# EAGLE design light-box-controller (EAGLE 9.6.2)

## Sheet 1 of 2
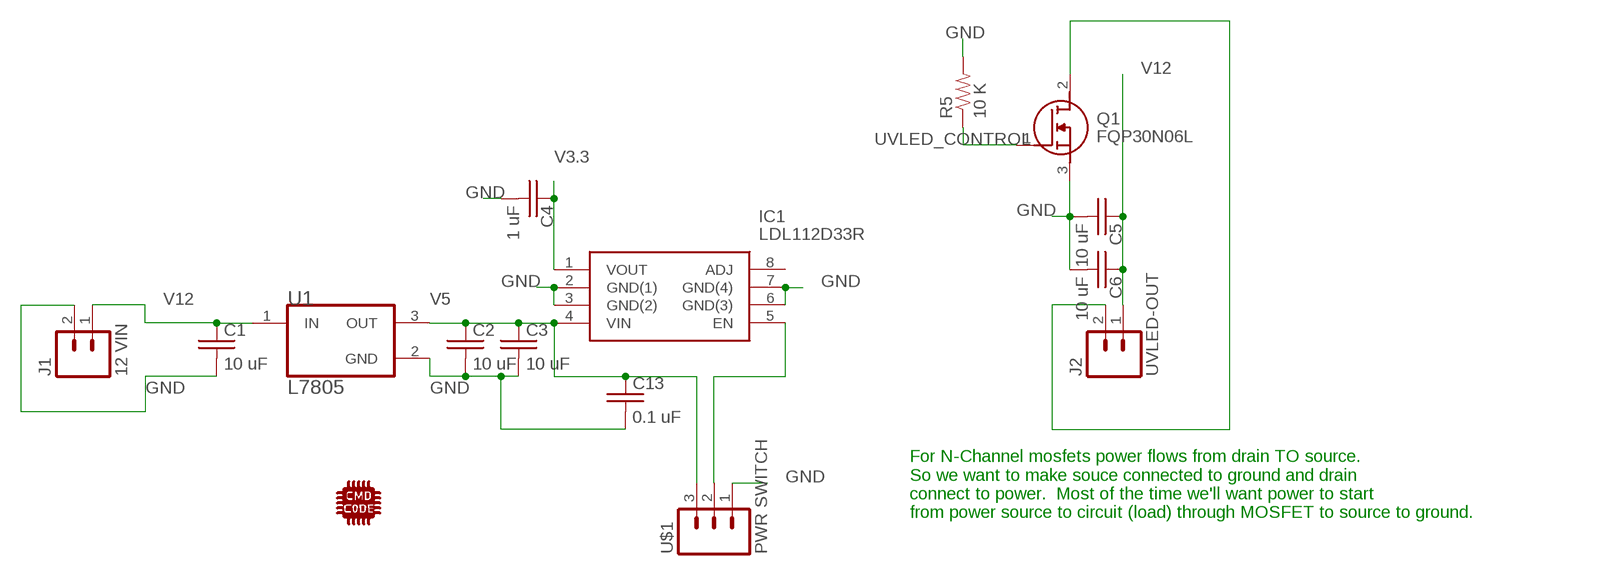
[diagram p0: schematic, sheet 1]

### Parts
C1  10 uF  C-USC0805K  [C0805K]
C2  10 uF  C-USC0805K  [C0805K]
C3  10 uF  C-USC0805K  [C0805K]
C4  1 uF  C-USC0805K  [C0805K]
C5  10 uF  C-USC0805K  [C0805K]
C6  10 uF  C-USC0805K  [C0805K]
C13  0.1 uF  C-USC0805K  [C0805K]
IC1  LDL112D33R  [SOIC127P600X175-8N]
J1  12 VIN  M025MM  [SCREWTERMINAL-5MM-2]
J2  UVLED-OUT  M025MM  [SCREWTERMINAL-5MM-2]
Q1  FQP30N06L  [TO254P470X1016X2019-3P]
R5  10 K  RESISTOR0805-RES  [0805]
U1  L7805  [TO-220-3]
U$1  PWR SWITCH  M03LONGPADS  [1X03_LONGPADS]
U$4  CMD_C0DE_LOGOCMD_CODE_LOGO_SILK  [CMD_C0DE_LOGO_SILK]

### Nets
GND: C1.2 C2.2 C3.2 C4.2 C5.2 C6.2 C13.2 IC1.2(GND(1)) IC1.3(GND(2)) IC1.6(GND(3)) IC1.7(GND(4)) J1.2 Q1.3(S) R5.2 U1.2(GND) U$1.1 ; also sheet 2
N$2: J2.2 Q1.2(D)
N$4: IC1.5(EN) U$1.2
UVLED_CONTROL: Q1.1(G) R5.1 ; also sheet 2
V3.3: C4.1 IC1.1(VOUT) ; also sheet 2
V5: C2.1 C3.1 C13.1 IC1.4(VIN) U1.3(OUT) U$1.3
V12: C1.1 C5.1 C6.1 J1.1 J2.1 U1.1(IN)
Unconnected: IC1.8(ADJ)

### Notes on the sheet
- For N-Channel mosfets power flows from drain TO source.  
  So we want to make souce connected to ground and drain 
  connect to power.  Most of the time we'll want power to start 
  from power source to circuit (load) through MOSFET to source to ground.

## Sheet 2 of 2
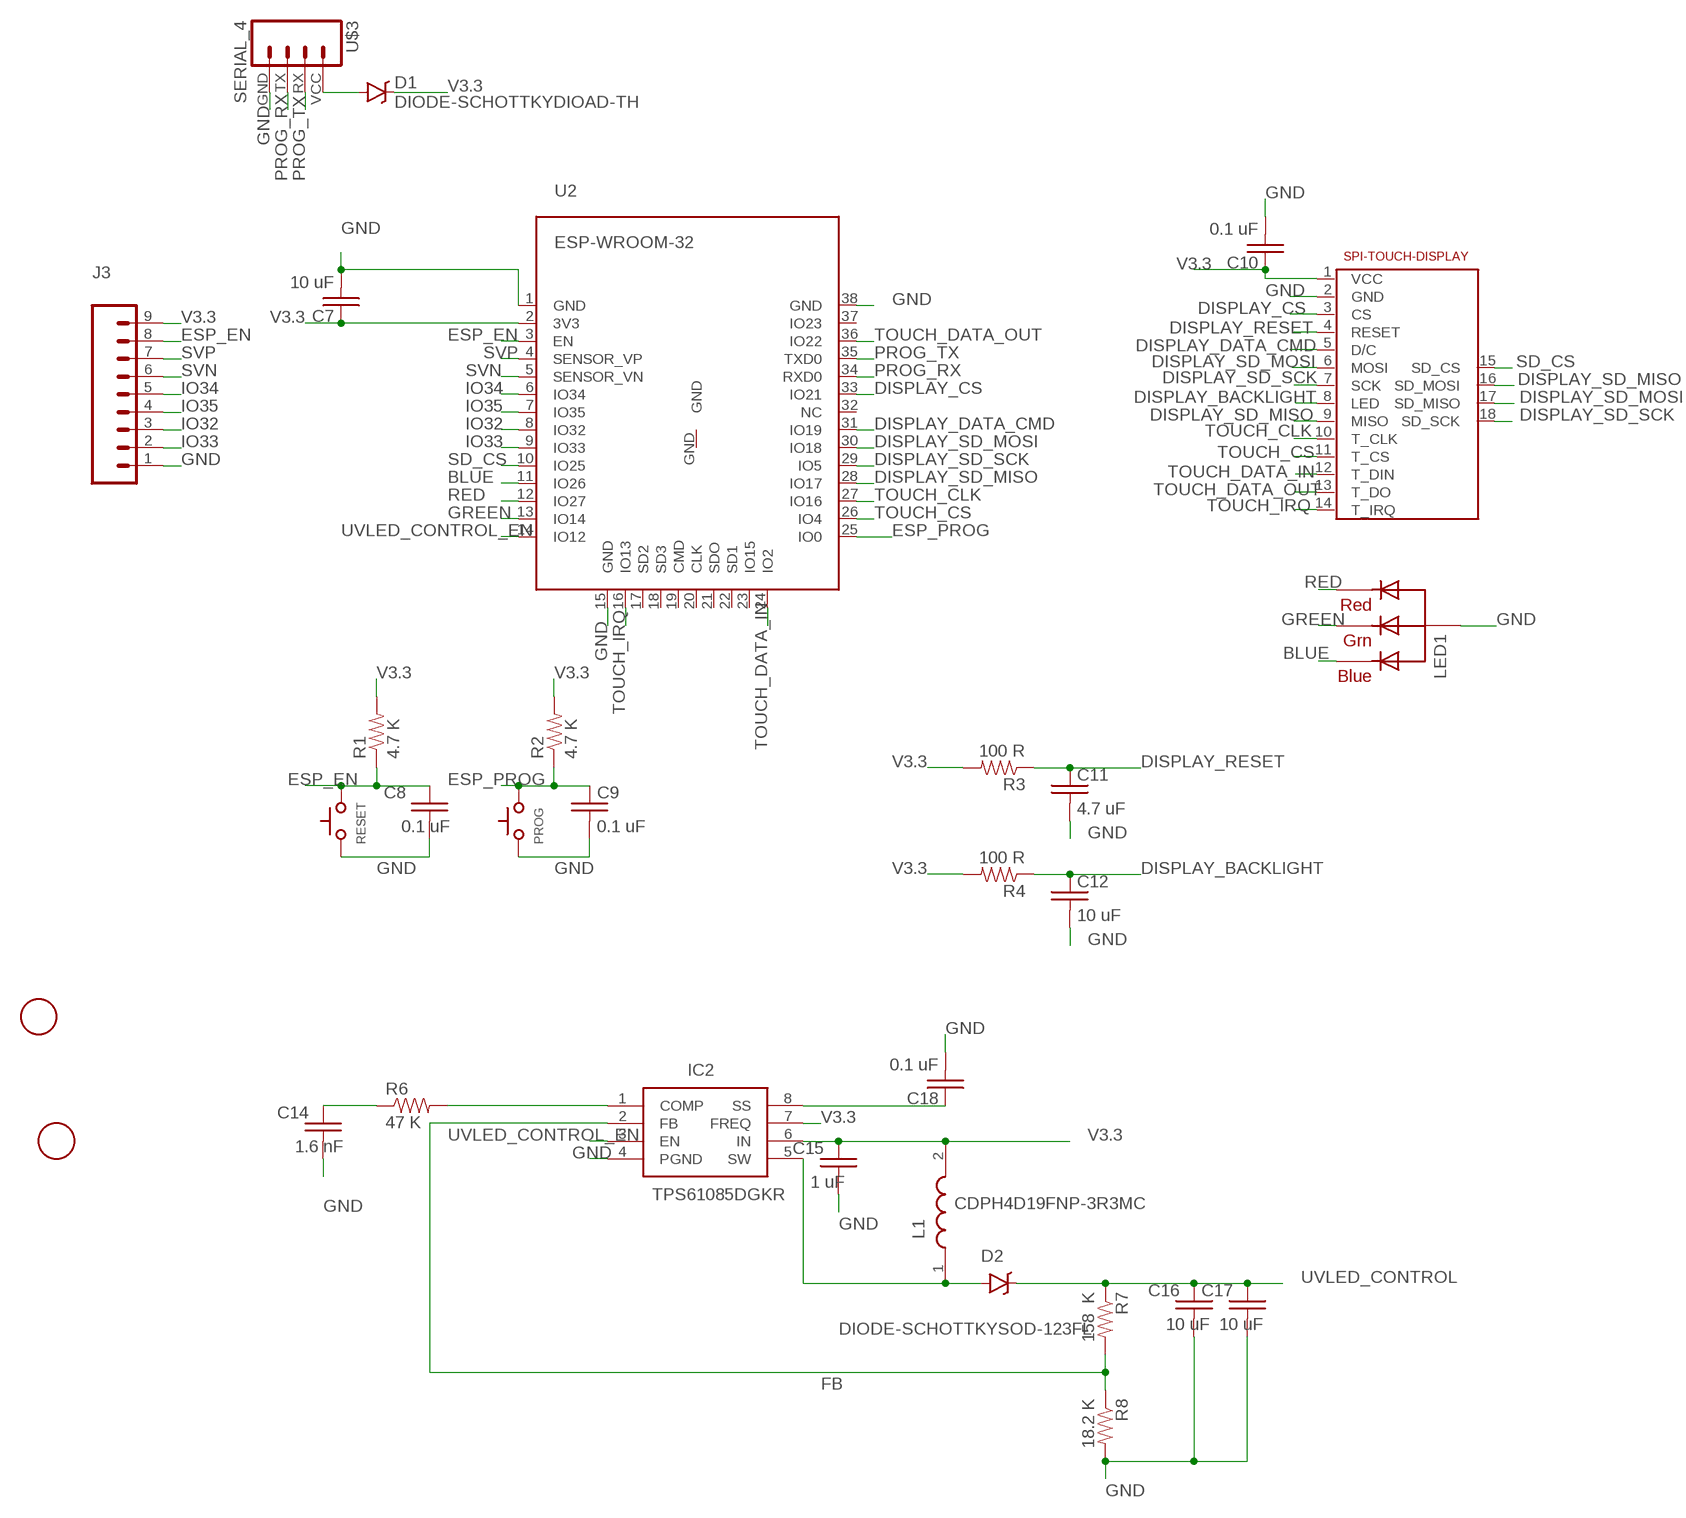
[diagram p1: schematic, sheet 2]

### Parts
C7  10 uF  C-USC0805K  [C0805K]
C8  0.1 uF  C-USC0805K  [C0805K]
C9  0.1 uF  C-USC0805K  [C0805K]
C10  0.1 uF  C-USC0805K  [C0805K]
C11  4.7 uF  C-USC0805K  [C0805K]
C12  10 uF  C-USC0805K  [C0805K]
C14  1.6 nF  C-USC0805K  [C0805K]
C15  1 uF  C-USC0805K  [C0805K]
C16  10 uF  C-USC0805K  [C0805K]
C17  10 uF  C-USC0805K  [C0805K]
C18  0.1 uF  C-USC0805K  [C0805K]
D1  DIODE-SCHOTTKYDIOAD-TH  [DIOAD1060W80L520D270]
D2  DIODE-SCHOTTKYSOD-123FL  [SOD-123FL]
IC2  TPS61085DGKR  [SOP65P490X110-8N]
J3  M09LONGPADS  [1X09_LONGPADS]
L1  CDPH4D19FNP-3R3MC  [CDPH4D19FNP3R3MC]
LED1  RGBLED_CA-PIRANHA  [PIRANHA5MM]
PROG  SWITCH_TACTILETACTILE-2PIN-NARROW  [TACTILE-2PIN-NARROW]
R1  4.7 K  RESISTOR0805-RES  [0805]
R2  4.7 K  RESISTOR0805-RES  [0805]
R3  100 R  RESISTOR0805-RES  [0805]
R4  100 R  RESISTOR0805-RES  [0805]
R6  47 K  RESISTOR0805-RES  [0805]
R7  158 K  RESISTOR0805-RES  [0805]
R8  18.2 K  RESISTOR0805-RES  [0805]
RESET  SWITCH_TACTILETACTILE-2PIN-NARROW  [TACTILE-2PIN-NARROW]
U2  ESP-WROOM-32  [ESP-WROOM-32]
U$2  2.4-SPI-TFT-TOUCH-SSD-MODULE  [2.4-SPI-TFT-TOUCH-SSD-MODULE]
U$3  SERIAL_4  [SERIAL_HEADER_4]
U$5  FIDUCIAL  [FIDUCIAL_1MM]
U$6  FIDUCIAL  [FIDUCIAL_1MM]

### Nets
BLUE: LED1.1(BLUE) U2.11(IO26)
DISPLAY_BACKLIGHT: C12.1 R4.1 U$2.8(LED)
DISPLAY_CS: U2.33(IO21) U$2.3(CS)
DISPLAY_DATA_CMD: U2.31(IO19) U$2.5(D/C)
DISPLAY_RESET: C11.1 R3.1 U$2.4(RESET)
DISPLAY_SD_MISO: U2.28(IO17) U$2.9(MISO) U$2.16(SD_MOSI)
DISPLAY_SD_MOSI: U2.30(IO18) U$2.6(MOSI) U$2.17(SD_MISO)
DISPLAY_SD_SCK: U2.29(IO5) U$2.7(SCK) U$2.18(SD_SCK)
ESP_EN: C8.1 J3.8 R1.1 RESET.P$1(A) U2.3(EN)
ESP_PROG: C9.1 PROG.P$1(A) R2.1 U2.25(IO0)
FB: IC2.2(FB) R7.2 R8.1
GND: C7.2 C8.2 C9.2 C10.2 C11.2 C12.2 C14.2 C15.2 C16.2 C17.2 C18.2 IC2.4(PGND) J3.1 LED1.4(VCC) PROG.P$2(C) R8.2 RESET.P$2(C) U2.1(GND) U2.15(GND) U2.38(GND) U$2.2(GND) U$3.GND ; also sheet 1
GREEN: LED1.3(GREEN) U2.13(IO14)
IO32: J3.3 U2.8(IO32)
IO33: J3.2 U2.9(IO33)
IO34: J3.5 U2.6(IO34)
IO35: J3.4 U2.7(IO35)
N$1: D1.A U$3.VCC
N$3: IC2.1(COMP) R6.2
N$5: C14.1 R6.1
N$8: C18.1 IC2.8(SS)
PROG_RX: U2.34(RXD0) U$3.TX
PROG_TX: U2.35(TXD0) U$3.RX
RED: LED1.2(RED) U2.12(IO27)
SD_CS: U2.10(IO25) U$2.15(SD_CS)
SVN: J3.6 U2.5(SENSOR_VN)
SVP: J3.7 U2.4(SENSOR_VP)
TOUCH_CLK: U2.27(IO16) U$2.10(T_CLK)
TOUCH_CS: U2.26(IO4) U$2.11(T_CS)
TOUCH_DATA_IN: U2.24(IO2) U$2.12(T_DIN)
TOUCH_DATA_OUT: U2.36(IO22) U$2.13(T_DO)
TOUCH_IRQ: U2.16(IO13) U$2.14(T_IRQ)
UVLED_BEFORE_DIODE: D2.A IC2.5(SW) L1.1
UVLED_CONTROL: C16.1 C17.1 D2.C R7.1 ; also sheet 1
UVLED_CONTROL_EN: IC2.3(EN) U2.14(IO12)
V3.3: C7.1 C10.1 C15.1 D1.C IC2.6(IN) IC2.7(FREQ) J3.9 L1.2 R1.2 R2.2 R3.2 R4.2 U2.2(3V3) U$2.1(VCC) ; also sheet 1
Unconnected: U2.17(SD2) U2.18(SD3) U2.19(CMD) U2.20(CLK) U2.21(SDO) U2.22(SD1) U2.23(IO15) U2.32(NC) U2.37(IO23) U2.GND

## Library data of the parts
C1-C18 = passives:C-US: CAPACITOR, American symbol
D1 D2 = passives:DIODE-SCHOTTKY
IC1 = voltage-regulator:LDL112D33R: LDO Voltage Regulators 1.2 A low quiescent current LDO with reverse current protection Source: Datasheet <https://www.arrow.com/en/products/ldl112d33r/stmicroelectronics>; ARROW_PART_NUMBER: LDL112D33R; ARROW_PRICE/STOCK: https://www.arrow.com/en/products/ldl112d33r/stmicroelectronics; DESCRIPTION: LDO Voltage Regulators 1.2 A low quiescent current LDO with reverse current protection; HEIGHT: 1.75mm; MANUFACTURER_NAME: STMicroelectronics; MANUFACTURER_PART_NUMBER: LDL112D33R
IC2 = dc-converters:TPS61085DGKR: 18.5V, 2A, 650kHz / 1.2MHz Step-Up DC-DC Converter w/ Forced PWM Mode Source: Datasheet <http://www.ti.com/general/docs/suppproductinfo.tsp?distId=10&gotoUrl=http://www.ti.com/lit/gpn/tps61085>; DESCRIPTION: 18.5V, 2A, 650kHz / 1.2MHz Step-Up DC-DC Converter w/ Forced PWM Mode; HEIGHT: 1.1mm; MANUFACTURER_NAME: Texas Instruments; MANUFACTURER_PART_NUMBER: TPS61085DGKR; MOUSER_PART_NUMBER: 595-TPS61085DGKR; MOUSER_PRICE-STOCK: https://www.mouser.co.uk/ProductDetail/Texas-Instruments/TPS61085DGKR?qs=59Rn2Bt6jP0PB7IUu7UPlw%3D%3D
J1 J2 = connector:M02: Standard 2-pin 0.1" header. Use with - straight break away headers ( PRT-00116) - right angle break away headers (PRT-00553) - swiss pins (PRT-00743) - machine pins (PRT-00117) - female headers (PRT-00115) Molex polarized connector foot print use with: PRT-08233 with associated crimp pins and housings. 2.54_SCREWTERM for use with PRT-10571. 3.5mm Screw Terminal footprints for PRT-08084 5mm Screw Terminal footprints for use with PRT-08432; STOREFRONT_ID: PRT-08432
J3 = connector:M09: Header 9 Standard 9-pin 0.1" header. Use with straight break away headers (SKU : PRT-00116), right angle break away headers (PRT-00553), swiss pins (PRT-00743), machine pins (PRT-00117), and female headers (PRT-00115).
L1 = passives:CDPH4D19FNP-3R3MC: Fixed Inductors 3.3uH 1.5A 26ohms Source: Datasheet <https://componentsearchengine.com/Datasheets/1/CDPH4D19FNP-3R3MC.pdf>; DESCRIPTION: Fixed Inductors 3.3uH 1.5A 26ohms; HEIGHT: 2mm; MANUFACTURER_NAME: Sumida; MANUFACTURER_PART_NUMBER: CDPH4D19FNP-3R3MC; MOUSER_PART_NUMBER: 851-CDPH4D19FNP3R3MC; MOUSER_PRICE-STOCK: https://www.mouser.com/Search/Refine.aspx?Keyword=851-CDPH4D19FNP3R3MC
LED1 = leds:RGBLED_CA: RGB LED, common-anode 5MM Staggered pins 5mm Piranha package http://www.ladyada.net/library/pcb/eaglelibrary.html
PROG RESET = switches:SWITCH_TACTILE
Q1 = transitors:FQP30N06L: FQP30N06L N-Channel MOSFET, 32 A, 60 V QFET, 3-Pin TO-220 ON Semiconductor Source: Datasheet <https://www.mouser.com/datasheet/2/308/FQP30N06L-1306227.pdf>; DESCRIPTION: FQP30N06L N-Channel MOSFET, 32 A, 60 V QFET, 3-Pin TO-220 ON Semiconductor; HEIGHT: 4.7mm; MANUFACTURER_NAME: ON Semiconductor; MANUFACTURER_PART_NUMBER: FQP30N06L; MOUSER_PART_NUMBER: 512-FQP30N06L; RS_PART_NUMBER: 8075863P; RS_PRICE-STOCK: http://uk.rs-online.com/web/p/products/8075863P
R1-R8 = passives:RESISTOR: Resistor Basic schematic elements and footprints for 0603, 1206, and PTH resistors.
U1 = voltage-regulator:L7805: IC REG LINEAR 5V 1.2A TO220AB; AVAILABILITY: Unavailable; DESCRIPTION: Linear Voltage Regulator IC 1 Output 1.2A TO-220AB; MF: STMicroelectronics; MP: L7805; PACKAGE: TO-220 Texas Instruments; PRICE: None
U2 = ICs:ESP-WROOM-32
U$1 = connector:M03: Header 3 Standard 3-pin 0.1" header. Use with straight break away headers (SKU : PRT-00116), right angle break away headers (PRT-00553), swiss pins (PRT-00743), machine pins (PRT-00117), and female headers (PRT-00115). Molex polarized connector foot print use with SKU : PRT-08232 with associated crimp pins and housings.
U$2 = displays:2.4-SPI-TFT-TOUCH-SSD-MODULE: 2.4" SPI TFT Module Driver: ILI9341 DOTS: 240x320 Touch: YES
U$3 = connector:SERIAL_4
U$4 = logos:CMD_C0DE_LOGO
U$5 U$6 = logos:FIDUCIAL: For use by pick and place machines to calibrate the vision/machine, 1mm By microbuilder.eu

## Board
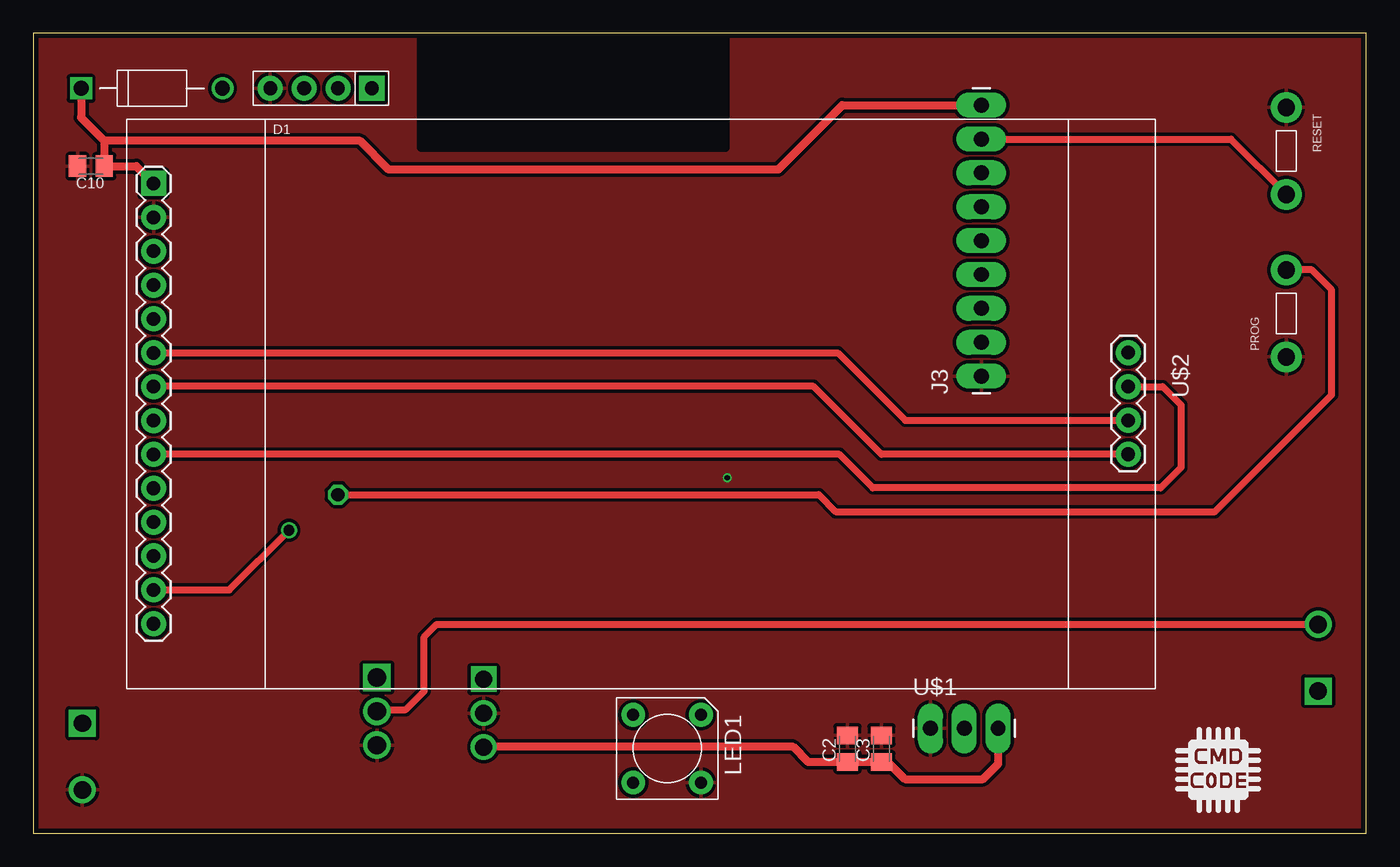
[diagram p2: board, top side]
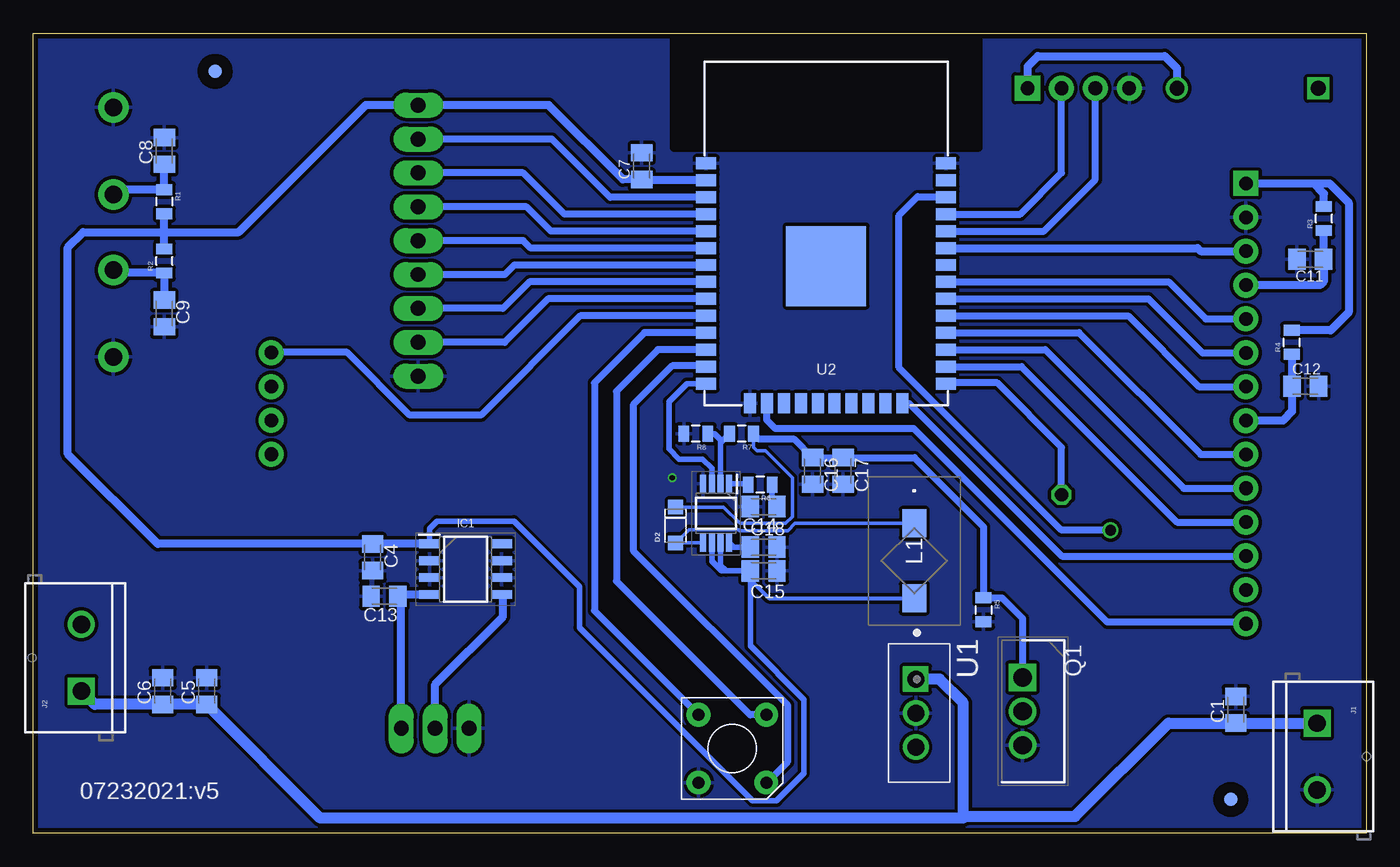
[diagram p3: board, bottom side, seen from below]

Size 100 x 60 mm. Coordinates in mm from the lower left corner, seen from the top.
Outline: 0,0 100,0 100,60 0,60 0,0
Copper layers (1*16): Top 0.035559375mm / dielectric 1.6mm / Bottom 0.035559375mm
Design rules "oshpark-2layer": minimum track width 6mil, minimum drill 10mil, track to track 6mil, track to pad 6mil, pad to pad 6mil, via to via 6mil, smd to smd 6mil, copper to edge 15mil, drill to drill 6mil, minimum pad ring 5mil, minimum via ring 5mil, stop-mask expansion 2.5mil, vias tented up to drill 0mil, thermal gap 10mil

### Footprints (pad centres in the part's own frame; a part is rotated, then mirrored left to right if it is on the bottom)
C0805K = smd 1.3 x 1.6: 1 -1,0; 2 1,0
DIOAD1060W80L520D270 = drill 1.1 pad 1.65: A 5.3,0 | drill 1.1 pad 1.65 square: C -5.3,0
SOD-123FL = smd 1.1 x 1.1: A -1.35,0; C 1.35,0
SOIC127P600X175-8N = smd 1.525 x 0.65: 1 -2.712,1.905; 2 -2.712,0.635; 3 -2.712,-0.635; 4 -2.712,-1.905; 5 2.712,-1.905; 6 2.712,-0.635; 7 2.712,0.635; 8 2.712,1.905
SOP65P490X110-8N = smd 1.4 x 0.45: 1 -2.2,0.975; 2 -2.2,0.325; 3 -2.2,-0.325; 4 -2.2,-0.975; 5 2.2,-0.975; 6 2.2,-0.325; 7 2.2,0.325; 8 2.2,0.975
SCREWTERMINAL-5MM-2 = drill 1.3 pad 2.032 square: 1 0,0 | drill 1.3 pad 2.032: 2 5,0
1X09_LONGPADS = drill 1.118 pad 1.88 long: 1 0,0; 2 2.54,0; 3 5.08,0; 4 7.62,0; 5 10.16,0; 6 12.7,0; 7 15.24,0; 8 17.78,0; 9 20.32,0
CDPH4D19FNP3R3MC = smd 2.1 x 1.8: 1 -2.8,0; 2 2.8,0
PIRANHA5MM = drill 0.9 pad 1.778: 1 -2.54,2.54; 2 -2.54,-2.54; 3 2.54,-2.54; 4 2.54,2.54
TACTILE-2PIN-NARROW = drill 1.3 pad 2.3: P$1 3.264,0; P$2 -3.264,0
TO254P470X1016X2019-3P = drill 1.37 pad 2.055 square: 1 0,0 | drill 1.37 pad 2.055: 2 2.535,0; 3 5.07,0
0805 = smd 0.8 x 1.2: 1 -0.9,0; 2 0.9,0
TO-220-3 = drill 1.27 pad 1.91 square: 1 -2.55,-0.26 | drill 1.27 pad 1.93: 2 0,-0.26; 3 2.55,-0.26
ESP-WROOM-32 = smd 0.9 x 1.5: 1 7.7,9; 2 6.43,9; 3 5.16,9; 4 3.89,9; 5 2.62,9; 6 1.35,9; 7 0.08,9; 8 -1.19,9; 9 -2.46,9; 10 -3.73,9; 11 -5,9; 12 -6.27,9; 13 -7.54,9; 14 -8.81,9; 25 -8.81,-9; 26 -7.54,-9; 27 -6.27,-9; 28 -5,-9; 29 -3.73,-9; 30 -2.46,-9; 31 -1.19,-9; 32 0.08,-9; 33 1.35,-9; 34 2.62,-9; 35 3.89,-9; 36 5.16,-9; 37 6.43,-9; 38 7.7,-9 | smd 1.5 x 0.9: 15 -10.3,5.715; 16 -10.3,4.445; 17 -10.3,3.175; 18 -10.3,1.905; 19 -10.3,0.635; 20 -10.3,-0.635; 21 -10.3,-1.905; 22 -10.3,-3.175; 23 -10.3,-4.445; 24 -10.3,-5.715 | smd 6 x 6: GND 0,0
1X03_LONGPADS = drill 1.118 pad 1.88 long: 1 0,0; 2 2.54,0; 3 5.08,0
2.4-SPI-TFT-TOUCH-SSD-MODULE = drill 1.016 pad 1.88 square: 1 4.83,2.02 | drill 1.016 pad 1.88: 2 7.37,2.02; 3 9.91,2.02; 4 12.45,2.02; 5 14.99,2.02; 6 17.53,2.02; 7 20.07,2.02; 8 22.61,2.02; 9 25.15,2.02; 10 27.69,2.02; 11 30.23,2.02; 12 32.77,2.02; 13 35.31,2.02; 14 37.85,2.02; 15 17.52,75.14; 16 20.06,75.14; 17 22.6,75.14; 18 25.14,75.14
SERIAL_HEADER_4 = drill 1.016 pad 1.88: GND 3.81,0; RX -1.27,0; TX 1.27,0 | drill 1.016 pad 1.88 square: VCC -3.81,0
FIDUCIAL_1MM = smd 1 x 1: 1 0,0

### Placement (x,y rotation side)
C1  9.78,9.27 90 bottom
C2  61.09,6.35 90 top
C3  63.63,6.35 90 top
C4  74.55,20.7 270 bottom
C5  87,10.67 90 bottom
C6  90.3,10.67 90 bottom
C7  54.36,50.04 90 bottom
C8  90.17,51.18 90 bottom
C9  90.17,38.99 270 bottom
C10  4.32,50.04 180 top
C11  4.19,43.05 180 bottom
C12  4.57,33.53 0 bottom
C13  73.66,17.78 180 bottom
C14  45.21,24.51 180 bottom
C15  45.21,19.68 0 bottom
C16  41.53,27.18 270 bottom
C17  39.24,27.18 270 bottom
C18  45.21,21.46 0 bottom
D1  8.89,55.88 0 top
D2  51.82,23.11 90 bottom
IC1  67.56,19.81 0 bottom
IC2  48.77,24 270 bottom
J1  3.68,8.26 270 bottom
J2  96.39,10.67 90 bottom
J3  71.12,34.29 90 top
L1  33.91,20.45 270 bottom
LED1  47.55,6.35 270 top
PROG  94,38.99 90 top
Q1  25.78,11.68 270 bottom
R1  90.17,47.37 270 bottom
R2  90.17,42.93 90 bottom
R3  3.17,46.1 90 bottom
R4  5.59,36.83 90 bottom
R5  28.7,16.76 270 bottom
R6  45.47,26.16 180 bottom
R7  46.86,29.97 180 bottom
R8  50.29,29.97 180 bottom
RESET  94,51.18 270 top
U1  33.53,9.02 270 bottom
U2  40.51,42.55 90 bottom
U$1  67.31,7.87 0 top
U$2  7,53.57 270 top
U$3  21.59,55.88 180 top
U$4  88.9,5.08 0 top
U$5  10.16,2.54 0 bottom
U$6  86.36,57.15 0 bottom

### Tracks (layer width: path | path; a pad name or v marks a point on that pad's centre or on a via)
BLUE
  Bottom 0.508: U2.11 54.15,37.55 57.91,33.78 57.91,16.71 LED1.1
DISPLAY_BACKLIGHT
  Bottom 0.61: R4.1 5.59,33.54 C12.1 5.57,31.64 6.25,30.96 U$2.8
DISPLAY_CS
  Bottom 0.61: U2.33 12.65,43.9 12.42,43.66 U$2.3
DISPLAY_DATA_CMD
  Bottom 0.508: U2.31 14.81,41.35 12.04,38.58 U$2.5
DISPLAY_RESET
  Bottom 0.61: R3.1 3.19,45.19 C11.1 3.19,41.39 3.46,41.12 U$2.4
DISPLAY_SD_MISO
  Top 0.508: U$2.16 84.73,33.51 86.11,32.13 86.11,27.43 84.58,25.91 62.99,25.91 60.48,28.42 U$2.9
  Bottom 0.508: U2.28 21.54,37.55 12.42,28.42 U$2.9
DISPLAY_SD_MOSI
  Top 0.508: U$2.6 60.35,36.04 65.42,30.97 U$2.17
  Bottom 0.508: U2.30 16.34,40.09 12.29,36.04 U$2.6
DISPLAY_SD_SCK
  Top 0.508: U$2.18 63.65,28.43 58.55,33.53 9.05,33.53 U$2.7
  Bottom 0.508: U2.29 17.86,38.81 12.54,33.5 U$2.7
ESP_EN
  Top 0.508: J3.8 89.85,52.07 RESET.P$1
  Bottom 0.508: U2.3 56.72,47.7 61.09,52.07 J3.8
  Bottom 0.61: RESET.P$1 93.66,48.26 R1.1 C8.1
ESP_PROG  (via drill 1)
  Top 0.508: v22.86,25.4 58.93,25.4 60.2,24.13 88.65,24.13 97.41,32.89 97.41,40.77 95.92,42.25 PROG.P$1
  Bottom 0.508: v22.86,25.4 22.86,28.96 27.69,33.78 31.47,33.78 U2.25
  Bottom 0.61: PROG.P$1 93.77,42.03 R2.1 C9.1
FB
  Bottom 0.406: IC2.2 48.44,29.21 48.44,29.29 | 48.44,29.29 48.44,29.52 48.9,29.97 R8.1 | 48.44,29.29 R7.2
GND  (via drill 0.4)
  other vias: 52.07,26.67
  pour Bottom (isolate 0.254): 0,59.69 0,0 100.33,0 100.33,59.69
  pour Top (isolate 0.254): 0,59.69 0,0 100.33,0 100.33,59.69
GREEN
  Bottom 0.508: U2.13 49.56,35.05 52.07,35.05 54.99,32.13 54.99,21.21 43.43,9.65 43.43,5.33 44.96,3.81 LED1.3
IO32
  Bottom 0.508: U2.8 62.78,41.35 64.77,39.37 J3.3
IO33
  Bottom 0.508: U2.9 61.39,40.09 64.64,36.83 J3.2
IO34
  Bottom 0.508: U2.6 62.69,43.9 63.25,44.45 J3.5
IO35
  Bottom 0.508: U2.7 63.93,42.62 64.64,41.91 J3.4
N$1
  Bottom 0.61: U$3.VCC 25.4,57.53 24.64,58.29 15.11,58.29 14.19,57.37 D1.A
N$2
  Top 0.508: Q1.2 25.9,9.27 27.94,9.27 29.34,10.67 29.34,14.73 30.27,15.67 J2.2
N$3
  Bottom 0.406: IC2.1 46.41,26.2 R6.2
N$4
  Bottom 0.61: U$1.2 69.85,11.18 64.77,16.26 64.77,17.82 IC1.5
N$5
  Bottom 0.406: R6.1 44.57,24.86 C14.1
N$8
  Bottom 0.406: IC2.8 47.45,21.46 C18.1
PROG_RX
  Bottom 0.508: U2.34 24.18,45.16 20.32,49.02 U$3.TX
PROG_TX
  Bottom 0.508: U2.35 25.95,46.44 22.86,49.53 U$3.RX
RED
  Bottom 0.508: U2.12 53.13,36.27 56.26,33.15 56.26,18.92 46.23,8.89 LED1.2
SD_CS
  Bottom 0.508: U2.10 58.98,38.81 66.42,31.37 71.75,31.37 76.45,36.07 82.12,36.07 U$2.15
SVN
  Bottom 0.508: U2.5 61.17,45.16 62.99,46.99 J3.6
SVP
  Bottom 0.508: U2.4 60.15,46.44 63.25,49.53 J3.7
TOUCH_CLK
  Bottom 0.508: U2.27 24.08,36.27 13.69,25.88 U$2.10
TOUCH_CS
  Bottom 0.508: U2.26 25.86,35.01 14.2,23.34 U$2.11
TOUCH_DATA_IN
  Bottom 0.508: U2.24 34.29,32.24 22.84,20.8 U$2.12
TOUCH_DATA_OUT  (via drill 0.8)
  Top 0.508: U$2.13 14.7,18.26 v19.18,22.73
  Bottom 0.508: U2.36 31.56,47.75 33.66,47.75 35.05,46.35 35.05,34.92 22.86,22.73 v19.18,22.73
TOUCH_IRQ
  Bottom 0.508: U2.16 44.96,30.99 44.32,30.35 33.94,30.35 19.43,15.85 9.15,15.85 U$2.14
UVLED_BEFORE_DIODE
  Bottom 0.254: IC2.5 51.78,21.8 D2.A 50.8,22.78 47.11,22.78 47.03,22.71 43.39,22.71 42.85,23.25 L1.1
UVLED_CONTROL
  Bottom 0.254: D2.C 48.21,24.46 46.99,23.24 43.56,23.24 43.05,23.75 43.05,26.67 45.09,28.7 45.72,28.7 45.96,28.95 R7.1
  Bottom 0.508: R7.1 45.58,29.59 42.94,29.59 C16.1 C17.1 33.89,28.18 28.7,22.99 R5.1 27.32,17.66 25.78,16.13 Q1.1
UVLED_CONTROL_EN
  Bottom 0.406: U2.14 50.97,33.73 52.32,32.38 52.32,28.83 51.56,28.07 49.78,28.07 49.09,27.38 IC2.3
V3.3
  Top 0.61: D1.C 3.59,53.69 5.33,51.94 | 5.33,51.94 5.33,50.05 C10.1 7.72,50.04 U$2.1 | 5.33,51.94 24.51,51.94 26.67,49.78 55.88,49.78 60.71,54.61 J3.9
  Bottom 0.305: C15.1 46.21,19.03 44.83,17.65 L1.2
  Bottom 0.406: IC1.1 70.28,22.86 69.72,23.41 63.94,23.41 59.03,18.5 59.03,15.43 46.03,2.44 44.24,2.44 42.19,4.49 42.19,10.03 46.21,14.05 C15.1 48.01,19.68 | 48.01,19.68 48.44,20.12 IC2.7 | 48.01,19.68 48.39,19.68 49.09,20.39 IC2.6
  Bottom 0.61: IC1.1 74.53,21.72 C4.1 90.66,21.7 97.41,28.45 97.41,43.94 96.27,45.09 90.17,45.09 | 90.17,45.09 84.58,45.09 75.06,54.61 J3.9 61.34,54.61 55.77,49.04 C7.1 54.29,48.98 U2.2 | 90.17,45.09 R1.2 | R2.2 90.17,45.09 | U$2.1 3.94,48.74 | 3.94,48.74 2.77,48.74 1.32,47.3 1.32,39.06 2.67,37.72 5.58,37.72 R4.2 | R3.2 3.17,47.98 3.94,48.74
V5
  Top 0.61: U$1.3 72.39,5.21 71.25,4.06 65.41,4.06 64.12,5.35 C3.1 C2.1 58.15,5.35 57.02,6.48 U1.3
  Bottom 0.61: U$1.3 72.39,17.51 C13.1 72.53,17.91 IC1.4
V12
  Bottom 0.813: 30.23,1.27 21.84,1.27 14.84,8.27 C1.1 3.7,8.27 J1.1 | J2.1 95.39,9.67 C6.1 C5.1 78.47,1.14 30.23,1.14 30.23,1.27 | U1.1 32.01,11.57 30.23,9.78 30.23,1.27

### Text on the board
bNames: 07232021:v5